# Altium schematic sheet Thermistor.SchDoc
size A; SheetNumber: 3; SheetTotal: 14
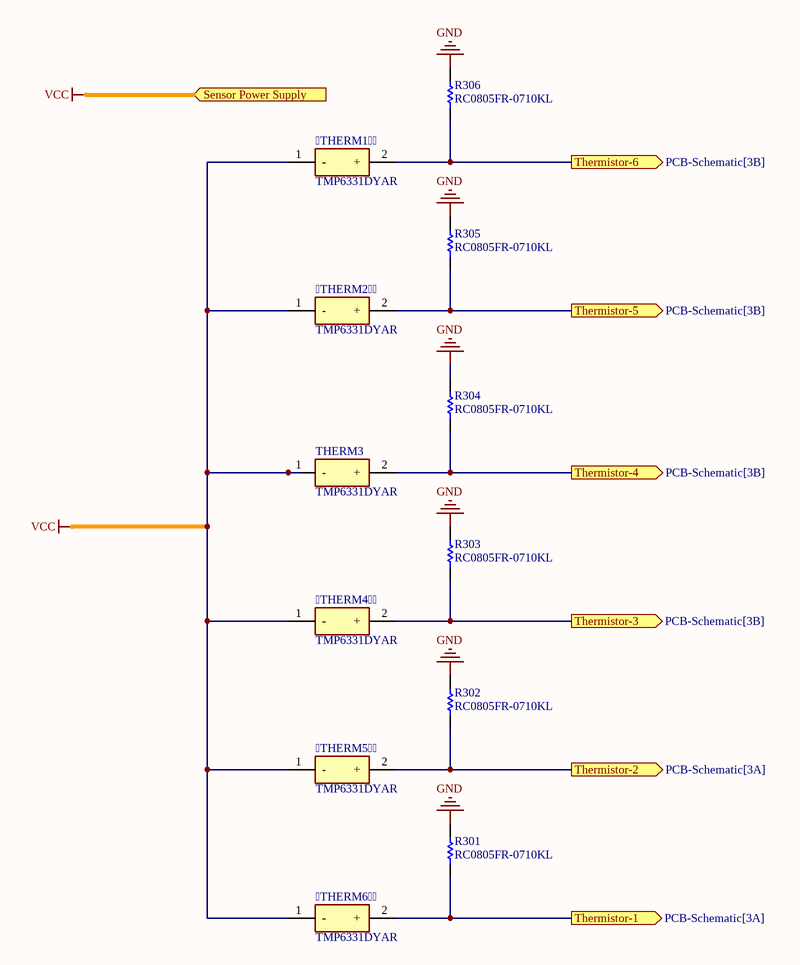
[diagram p0: Thermistor.SchDoc]

## Parts
THERM1  TMP6331DYAR  [TMP6331DYAR]
THERM2  TMP6331DYAR  [TMP6331DYAR]
THERM4  TMP6331DYAR  [TMP6331DYAR]
THERM5  TMP6331DYAR  [TMP6331DYAR]
THERM6  TMP6331DYAR  [TMP6331DYAR]
R301  RC0805FR-0710KL  [RESC2013X60X35NL10T20]
R302  RC0805FR-0710KL  [RESC2013X60X35NL10T20]
R303  RC0805FR-0710KL  [RESC2013X60X35NL10T20]
R304  RC0805FR-0710KL  [RESC2013X60X35NL10T20]
R305  RC0805FR-0710KL  [RESC2013X60X35NL10T20]
R306  RC0805FR-0710KL  [RESC2013X60X35NL10T20]
THERM3  TMP6331DYAR  [TMP6331DYAR]

## Ports
Sensor Power Supply (in, see PCB-Schematic[2A], ADC[2B], CurrentSense[2B], VRB[2B]), Thermistor-1 (out, see PCB-Schematic[3A]), Thermistor-2 (out, see PCB-Schematic[3A]), Thermistor-3 (out, see PCB-Schematic[3B]), Thermistor-4 (out, see PCB-Schematic[3B]), Thermistor-5 (out, see PCB-Schematic[3B]), Thermistor-6 (out, see PCB-Schematic[3B])

## Nets
GND: R301.2 R302.2 R303.2 R304.2 R305.2 R306.2
VCC: THERM1.1(-) THERM2.1(-) THERM4.1(-) THERM5.1(-) THERM6.1(-) THERM3.1(-) ; port Sensor Power Supply
Thermistor-1: THERM6.2(+) R301.1 ; port Thermistor-1
Thermistor-2: THERM5.2(+) R302.1 ; port Thermistor-2
Thermistor-3: THERM4.2(+) R303.1 ; port Thermistor-3
Thermistor-4: R304.1 THERM3.2(+) ; port Thermistor-4
Thermistor-5: THERM2.2(+) R305.1 ; port Thermistor-5
Thermistor-6: THERM1.2(+) R306.1 ; port Thermistor-6

## Library data of the parts
THERM1 THERM2 THERM4 THERM5 THERM6 THERM3 = TMP6331DYAR: PTC Thermistors +/-1% tolerance 100k linear thermistor available in an 0402 package 2-SOT-5X3 -40 to 150; Manufacturer_Name: Texas Instruments; Geometry.Height: 0.77mm; Mouser Part Number: 595-TMP6331DYAR; Mouser Price/Stock: https://www.mouser.co.uk/ProductDetail/Texas-Instruments/TMP6331DYAR?qs=7MVldsJ5UawI0UH0FIHgeA%3D%3D; Manufacturer_Part_Number: TMP6331DYAR; Datasheet Link: https://www.ti.com/lit/ds/symlink/tmp63.pdf?ts=1656390900860&ref_url=https%253A%252F%252Fwww.ti.com%252Fproduct%252FTMP63%252Fpart-details%252FTMP6331DYAR
R301-R306 = RC0805FR-0710KL: Chip Resistor, 10 KOhm, +/- 1%, 0.125 W, -55 to 155 degC, 0805 (2012 Metric), RoHS, Tape and Reel; Manufacturer: Yageo; Voltage Rating: 150 V; Mount: Surface Mount; ComponentLink1Description: Manufacturer URL; ComponentLink2URL: http://www.yageo.com/documents/recent/PYu-RC_Group_51_RoHS_L_04.pdf; Pins: 2; Length: 2 mm; Min Operating Temperature: -55 degC; Height: 0.5 mm; Mounting Technology: Surface Mount; RoHSCompliant: true; REACH SVHC: No SVHC; ComponentLink1URL: http://www.yageo.com/; Max Operating Temperature: 155 degC; PackageReference: 0805; DatasheetVersion: Rev. 4, 02/2016; Package Quantity: 5000; Packaging: Tape and Reel; ComponentLink2Description: Datasheet; PackageDescription: 2-Pin Surface Mounted Device, Body 2 x 1.25 mm